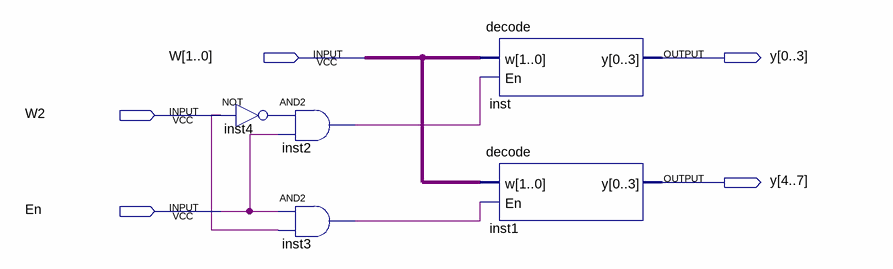
[diagram p0: schematic sheet]
// Quartus schematic DecodeBDF.bdf as structural Verilog: 5 symbols, 5 pins
module DecodeBDF (
  input  [1:0] W,
  input  W2,
  input  En,
  output [0:7] y
);

  wire inst2_out, inst3_out, inst4_out;

  and inst2 (inst2_out, inst4_out, En);
  not inst4 (inst4_out, W2);
  and inst3 (inst3_out, En, W2);
  decode inst (.w(W), .En(inst2_out), .y(y[0:3]));
  decode inst1 (.w(W), .En(inst3_out), .y(y[4:7]));
endmodule
